# EAGLE design RFG-controller (EAGLE 6.6.0)
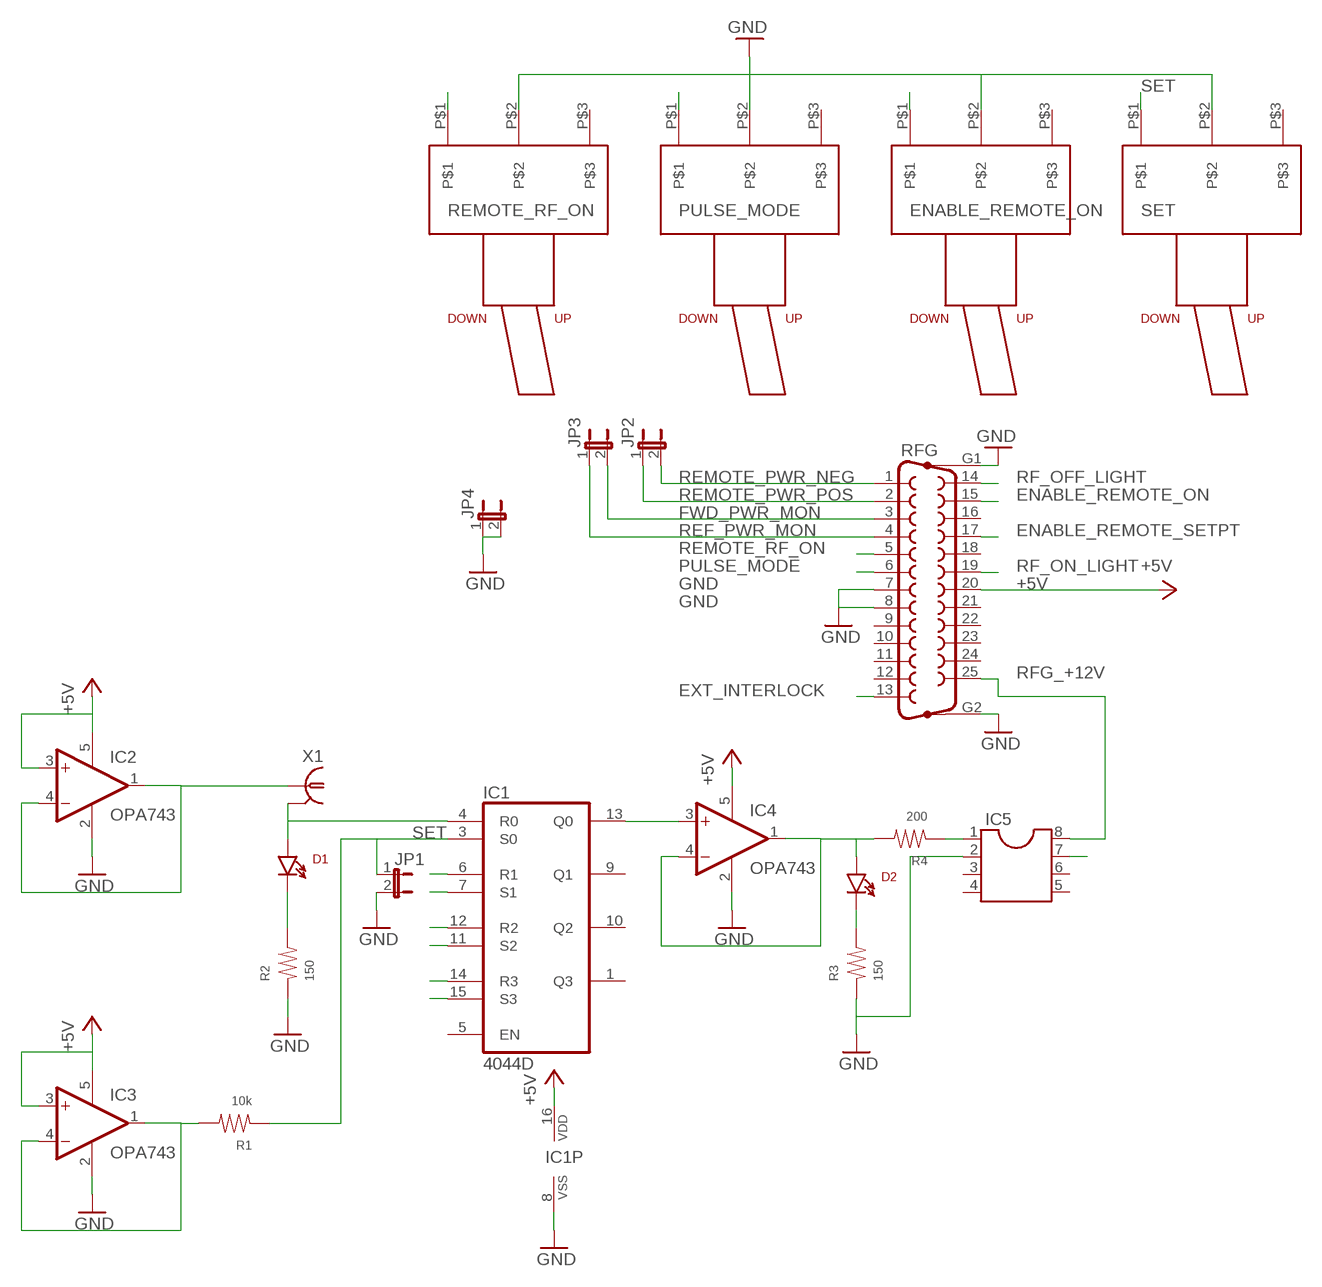
[diagram p0: schematic, sheet 1]

## Parts
D1  LED  [LTL-533-11]
D2  LED  [LTL-533-11]
ENABLE_REMOTE_ON  SPDT-TOGGLE  [7101MD9AV2BE]
IC1  4044D  [SO16]
IC2  OPA743  [SOT23-5]
IC3  OPA743  [SOT23-5]
IC4  OPA743  [SOT23-5]
IC5  DIL8  [DIL08]
JP1  JP1E  [JP1]
JP2  JP1E  [JP1]
JP3  JP1E  [JP1]
JP4  JP1E  [JP1]
PULSE_MODE  SPDT-TOGGLE  [7101MD9AV2BE]
R1  10k  RES0603  [0603]
R2  150  RES0603  [0603]
R3  150  RES0603  [0603]
R4  200  RES0603  [0603]
REMOTE_ON  SPDT-TOGGLE  [7101MD9AV2BE]
RFG  F25HP  [F25HP]
SET  SPDT-TOGGLE  [7101MD9AV2BE]
X1  BNC-H  [BNC90]

## Nets
+5V: IC1.16(VDD) IC2.3(+IN) IC2.5(V+) IC3.3(+IN) IC3.5(V+) IC4.5(V+) RFG.20
ENABLE_REMOTE_ON: ENABLE_REMOTE_ON.P$1 RFG.15
ENABLE_REMOTE_SETPT: RFG.17
EXT_INTERLOCK: IC5.7 RFG.13
FWD_PWR_MON: JP3.2 RFG.3
GND: ENABLE_REMOTE_ON.P$2 IC1.6(R1) IC1.7(S1) IC1.8(VSS) IC1.11(S2) IC1.12(R2) IC1.14(R3) IC1.15(S3) IC2.2(V-) IC3.2(V-) IC4.2(V-) IC5.2 JP1.2 JP4.1 JP4.2 PULSE_MODE.P$2 R2.1 R3.1 REMOTE_ON.P$2 RFG.7 RFG.8 RFG.G1 RFG.G2 SET.P$2
N$1: IC2.1(OUT) IC2.4(-IN) X1.1
N$2: IC3.1(OUT) IC3.4(-IN) R1.2
N$3: IC5.1 R4.1
N$6: D2.A IC4.1(OUT) IC4.4(-IN) R4.2
N$7: IC1.13(Q0) IC4.3(+IN)
N$9: D1.A IC1.4(R0) X1.2
N$10: D1.C R2.2
N$11: D2.C R3.2
PULSE_MODE: PULSE_MODE.P$1 RFG.6
REF_PWR_MON: JP3.1 RFG.4
REMOTE_PWR_NEG: JP2.2 RFG.1
REMOTE_PWR_POS: JP2.1 RFG.2
REMOTE_RF_ON: REMOTE_ON.P$1 RFG.5
RF_OFF_LIGHT: RFG.14
RF_ON_LIGHT: RFG.19
RFG_+12V: IC5.8 RFG.25
SET: IC1.3(S0) JP1.1 R1.1 SET.P$1
Unconnected: ENABLE_REMOTE_ON.P$3 IC1.1(Q3) IC1.5(EN) IC1.9(Q1) IC1.10(Q2) IC5.3 IC5.4 IC5.5 IC5.6 PULSE_MODE.P$3 REMOTE_ON.P$3 RFG.9 RFG.10 RFG.11 RFG.12 RFG.16 RFG.18 RFG.21 RFG.22 RFG.23 RFG.24 SET.P$3

## Notes on the sheet
- SET

## Library data of the parts
D1 D2 = Lin-Temp-Controller:LED: Through-hole, side-view LED; DIGIKEY: 160-1977-ND
ENABLE_REMOTE_ON PULSE_MODE REMOTE_ON SET = switch-jqi:SPDT-TOGGLE
IC1 = 40xx:4044: Quad 3-state NAND R/S LATCH
IC2-IC4 = linear:OPA743: 12V, 7MHz, CMOS, Rail-to-Rail I/O OP AMP Source: http://focus.ti.com/lit/ds/sbos201/sbos201.pdf; PARTNO: OPA743NA/3KCT-ND
IC5 = ic-package:DIL8: Dual In Line / Socket
JP1-JP4 = jumper:JP1E: JUMPER
R1-R4 = rlc-jqi:RES: SMT Resistor
RFG = con-subd:F25HP: SUB-D; OC_FARNELL: unknown; OC_NEWARK: unknown
X1 = connector-jqi:BNC: BNC Connector.; DIGIKEY: A32260-ND

## Board
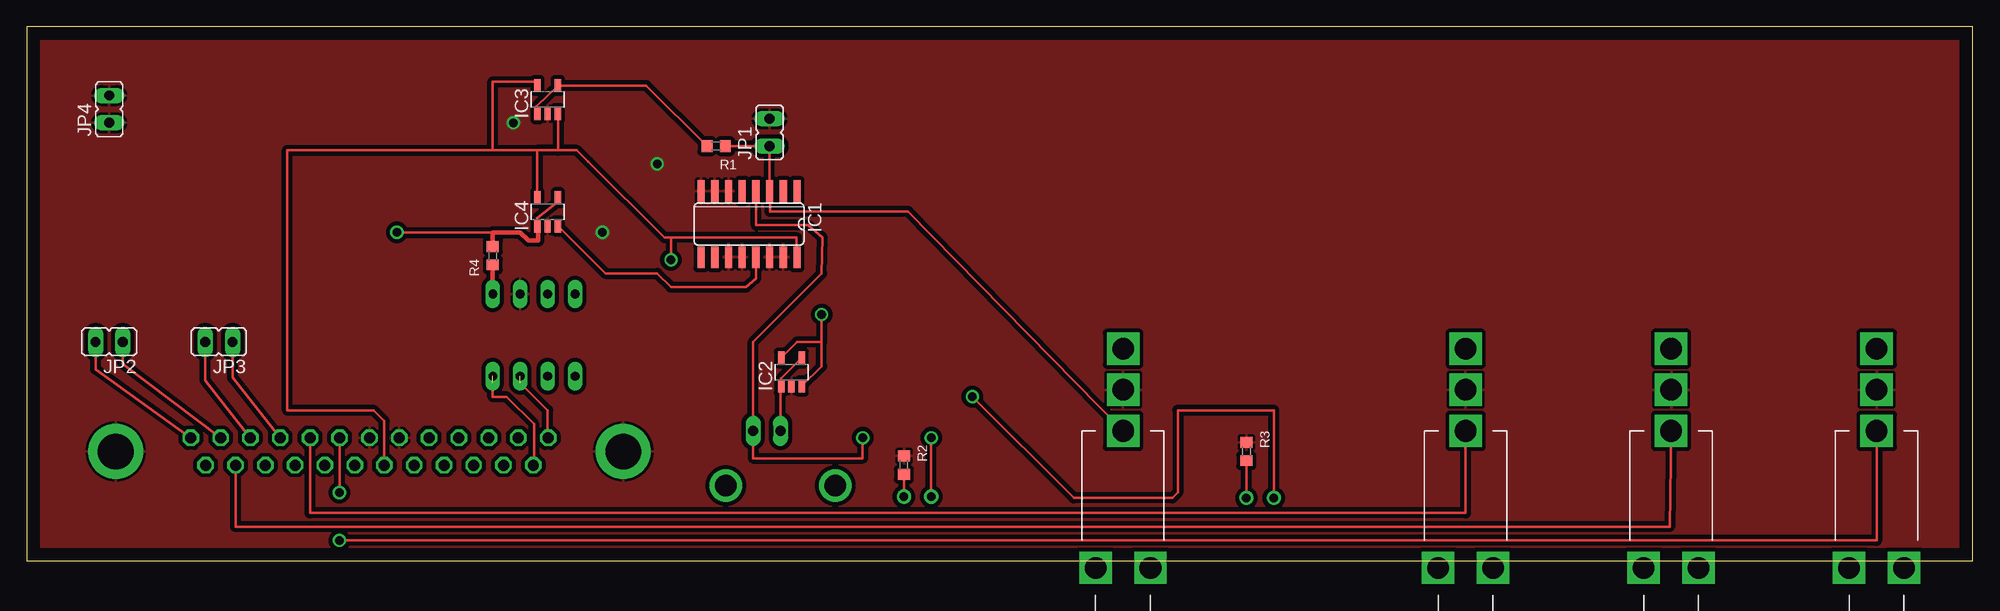
[diagram p1: board, top side]
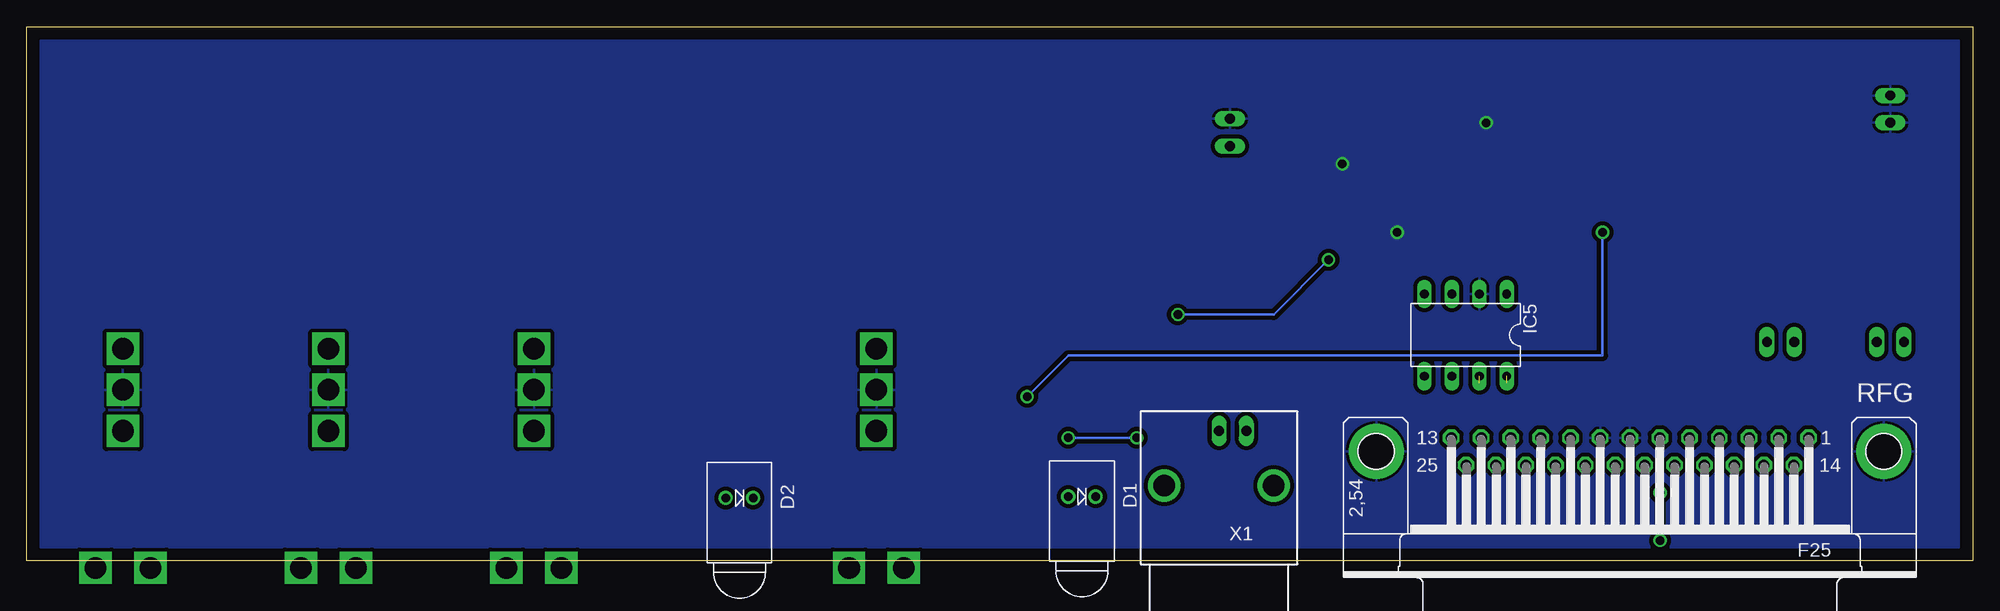
[diagram p2: board, bottom side, seen from below]

Size 180.34 x 49.53 mm. Coordinates in mm from the lower left corner, seen from the top.
Outline: 0,0 180.34,0 180.34,49.53 0,49.53 0,0
Copper layers (1*16): Top 0.035mm / dielectric 1.5mm / Bottom 0.035mm
Design rules "default": minimum track width 6mil, minimum drill 0.35mm, track to track 6mil, track to pad 6mil, pad to pad 6mil, via to via 6mil, smd to smd 6mil, copper to edge 40mil, drill to drill 6mil, minimum pad ring 10mil, minimum via ring 8mil, stop-mask expansion 4mil, vias tented up to drill 0mil, thermal gap 10mil

### Footprints (pad centres in the part's own frame; a part is rotated, then mirrored left to right if it is on the bottom)
LTL-533-11 = drill 0.8: A 1.27,0; C -1.27,0
7101MD9AV2BE = drill 2 square: P$1 0,0; P$2 0,3.81; P$3 0,7.62; P$4 -2.54,-12.7; P$5 2.54,-12.7
SO16 = smd 0.66 x 2.032: 1 -4.445,-3.073; 2 -3.175,-3.073; 3 -1.905,-3.073; 4 -0.635,-3.073; 5 0.635,-3.073; 6 1.905,-3.073; 7 3.175,-3.073; 8 4.445,-3.073; 9 4.445,3.073; 10 3.175,3.073; 11 1.905,3.073; 12 0.635,3.073; 13 -0.635,3.073; 14 -1.905,3.073; 15 -3.175,3.073; 16 -4.445,3.073
SOT23-5 = smd 0.6 x 1.2: 1 -0.95,-1.306; 2 0,-1.306; 3 0.95,-1.306; 4 0.95,1.306; 5 -0.95,1.306
DIL08 = drill 0.813 long: 1 -3.81,-3.81; 2 -1.27,-3.81; 3 1.27,-3.81; 4 3.81,-3.81; 5 3.81,3.81; 6 1.27,3.81; 7 -1.27,3.81; 8 -3.81,3.81
JP1 = drill 0.914 long: 1 0,-1.27; 2 0,1.27
0603 = smd 1 x 1.1: 1 -0.85,0; 2 0.85,0
F25HP = drill 1.016 octagon: 1 -16.561,-1.27; 2 -13.792,-1.27; 3 -11.049,-1.27; 4 -8.28,-1.27; 5 -5.512,-1.27; 6 -2.769,-1.27; 7 0,-1.27; 8 2.769,-1.27; 9 5.512,-1.27; 10 8.28,-1.27; 11 11.049,-1.27; 12 13.792,-1.27; 13 16.561,-1.27; 14 -15.189,1.27; 15 -12.421,1.27; 16 -9.652,1.27; 17 -6.909,1.27; 18 -4.14,1.27; 19 -1.372,1.27; 20 1.372,1.27; 21 4.14,1.27; 22 6.909,1.27; 23 9.652,1.27; 24 12.421,1.27; 25 15.189,1.27 | drill 3.302 pad 5.08: G1 -23.52,0; G2 23.52,0
BNC90 = drill 0.9 pad 1.27 long: 1 0,-5.08; 2 -2.54,-5.08 | drill 2 pad 2.032: ANCHOR1 -5.08,0; ANCHOR2 5.08,0

### Placement (x,y rotation side)
D1  82.55,5.97 180 bottom
D2  114.3,5.84 180 bottom
ENABLE_REMOTE_ON  152.4,12.06 0 top
IC1  66.93,31.24 180 top
IC2  70.87,17.53 0 top
IC3  48.26,42.8 0 top
IC4  48.26,32.38 0 top
IC5  46.99,20.95 180 bottom
JP1  68.83,39.75 0 top
JP2  7.62,20.32 90 top
JP3  17.78,20.32 90 top
JP4  7.62,41.91 0 top
PULSE_MODE  171.45,12.06 0 top
R1  63.88,38.48 180 top
R2  81.28,8.89 270 top
R3  113.03,10.16 270 top
R4  43.18,28.32 90 top
REMOTE_ON  133.35,12.06 0 top
RFG  31.75,10.16 180 bottom
SET  101.6,12.06 0 top
X1  69.85,6.99 180 bottom

### Tracks (layer width: path | path; a pad name or v marks a point on that pad's centre or on a via)
+5V  (via drill 0.81)
  Top 0.254: RFG.20 33.12,12.98 32.13,13.97 24.13,13.97 24.13,38.1 43.18,38.1 | IC2.3 73.66,18.06 73.66,20.32 | 73.66,20.32 71.4,20.32 IC2.5 | 43.18,38.1 43.18,44.45 47.31,44.45 IC3.5 | 43.18,38.1 47.31,38.1 | 47.31,38.1 IC4.5 | IC1.16 71.35,30 59.69,30 | 59.69,30 59.11,30 52.02,37.06 50.95,38.1 49.28,38.1 49.21,38.1 | 49.21,38.1 47.31,38.1 | 59.69,30 v59.69,27.94 | v73.66,22.86 73.66,20.32 | IC3.3 49.21,38.1
  Bottom 0.254: v59.69,27.94 64.77,22.86 v73.66,22.86
ENABLE_REMOTE_ON
  Top 0.254: ENABLE_REMOTE_ON.P$1 152.27,3.17 19.33,3.17 RFG.15
EXT_INTERLOCK  (1 unrouted)
  Top 0.254: RFG.13 48.26,11.43 48.26,13.97 45.72,16.51
FWD_PWR_MON
  Top 0.254: RFG.3 16.51,16.76 JP3.2
GND  (via drill 0.81)
  other vias: 45.09,40.64 58.42,36.83 53.34,30.48
  pour Top (isolate 0.381): 1.27,1.27 179.07,1.27 179.07,48.26 1.27,48.26
  pour Bottom (isolate 0.381): 1.27,48.26 1.27,1.27 179.07,1.27 179.07,48.26
N$1
  Top 0.254: X1.1 69.85,16.15 IC2.1 69.92,16.93 IC2.4
N$2
  Top 0.254: IC3.1 47.24,42.16 IC3.4 57.41,44.1 R1.2
N$3
  Top 0.406: IC5.1 R4.1
N$6  (via drill 0.81)
  Top 0.254: IC4.4 49.21,33.32 47.3,31.8 47.3,31.45 IC4.1 | v87.63,15.24 97.03,5.84 106.17,5.84 106.68,6.35 106.68,13.97 115.57,13.97 D2.A | v34.29,30.48 43.18,30.48
  Top 0.406: R4.2 43.18,30.48 45.72,30.48 46.48,29.72 47.37,29.72 47.37,31.08 IC4.1
  Bottom 0.254: v87.63,15.24 83.82,19.05 34.29,19.05 v34.29,30.48
N$7
  Top 0.254: IC4.3 53.62,26.67 58.42,26.67 59.69,25.4 66.65,25.4 67.56,26.21 IC1.13
N$9  (via drill 0.81)
  Top 0.254: IC1.4 67.59,31.14 72.42,31.14 73.74,30 73.66,26.67 67.31,20.32 X1.2 67.31,9.53 77.47,9.53 v77.47,11.43 | D1.A v83.82,11.43
  Bottom 0.254: v83.82,11.43 v77.47,11.43
N$10
  Top 0.254: D1.C R2.2
N$11
  Top 0.254: D2.C R3.2
PULSE_MODE  (via drill 0.81)
  Top 0.254: PULSE_MODE.P$1 171.45,1.91 v28.96,1.91 | v28.96,6.35 28.98,6.35 RFG.6
  Bottom 0.254: v28.96,1.91 v28.96,6.35
REF_PWR_MON
  Top 0.254: RFG.4 19.05,17.02 JP3.1
REMOTE_PWR_NEG
  Top 0.254: RFG.1 6.35,17.78 JP2.2
REMOTE_PWR_POS
  Top 0.254: RFG.2 8.89,18.29 JP2.1
REMOTE_RF_ON
  Top 0.254: REMOTE_ON.P$1 133.35,4.45 26.24,4.45 RFG.5
RFG_+12V  (1 unrouted)
  Top 0.254: RFG.25 46.99,8.89 46.99,12.7 44.45,15.24 43.18,15.24 43.18,16.51
SET
  Top 0.254: R1.1 JP1.1 IC1.3 68.86,32.41 81.69,32.41 SET.P$1